# Altium schematic sheet MCU.SchDoc
size 420 x 297 mm; SheetNumber: 12; SheetTotal: 13
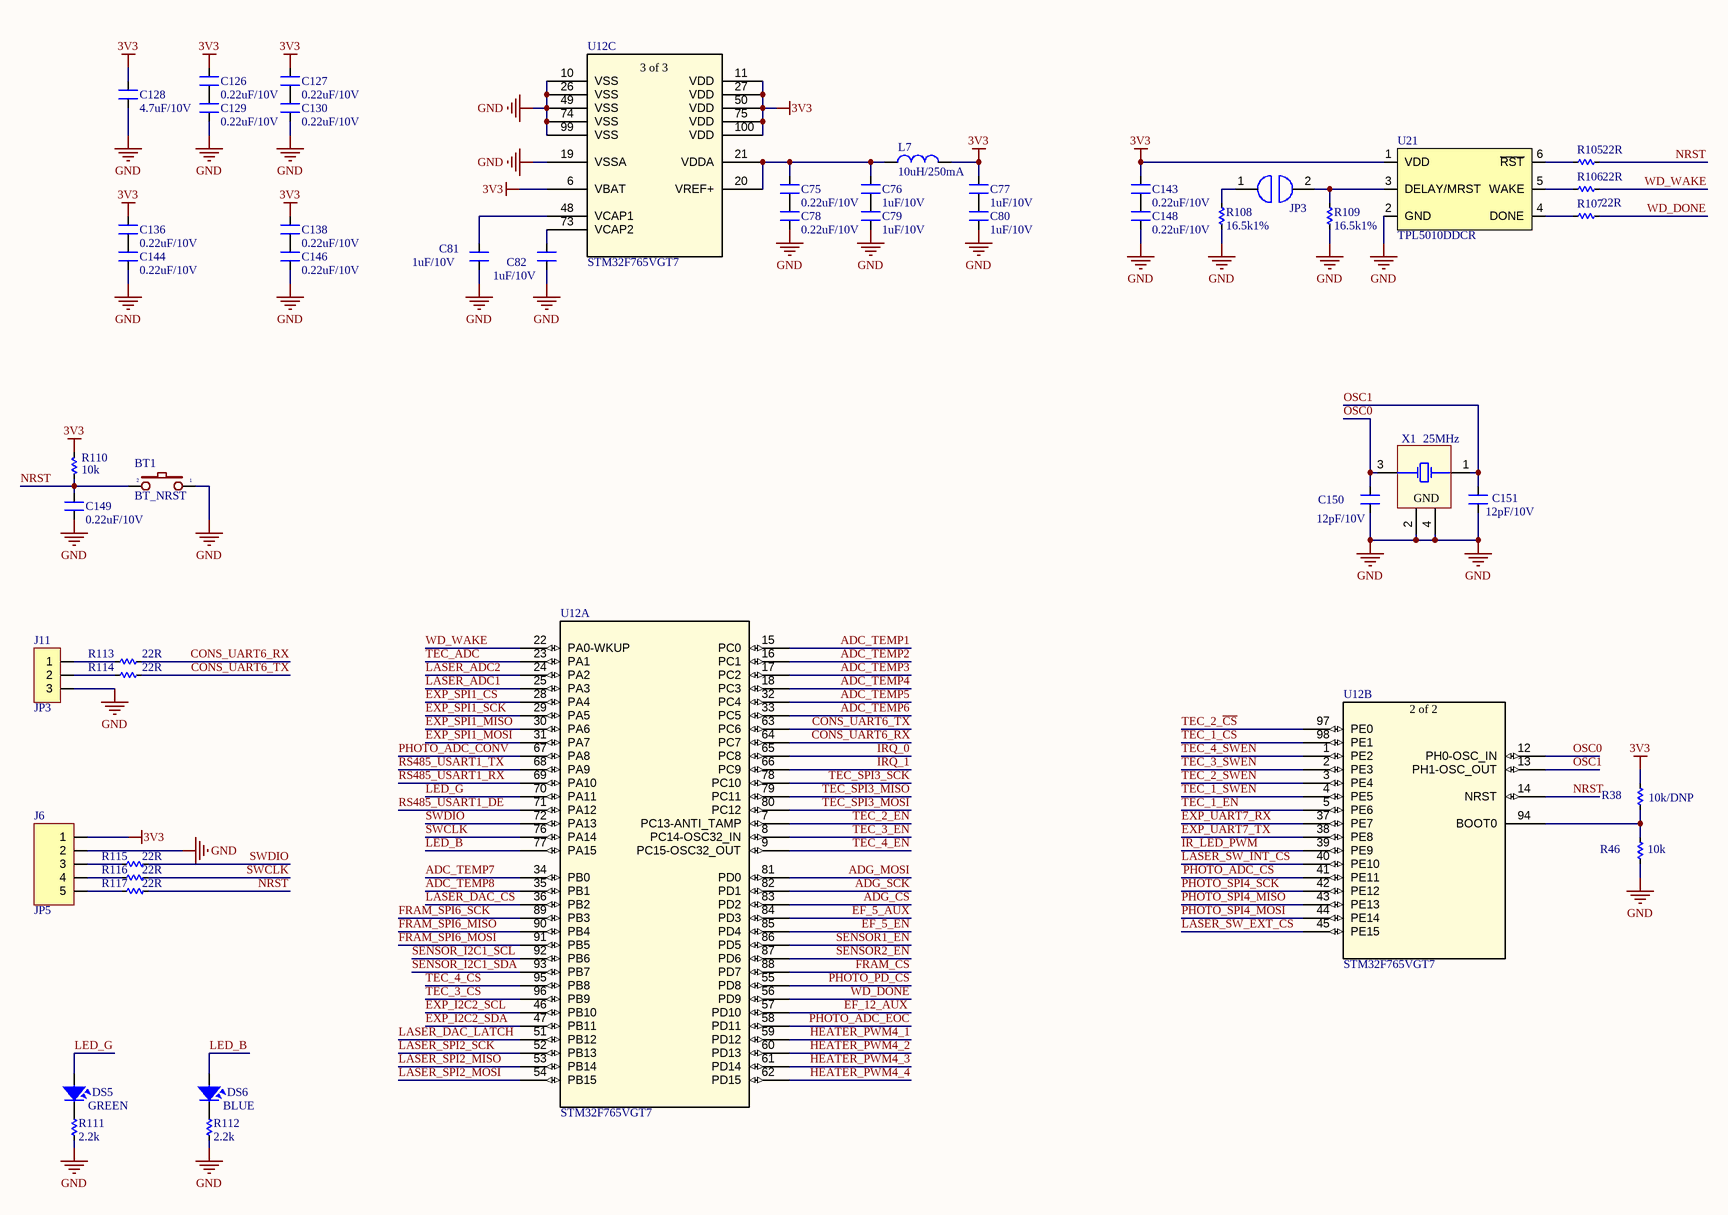
[diagram p0: MCU.SchDoc]

## Parts
BT1  BT_NRST  [SW1-SMD]
C75  0.22uF/10V  [CAP_C_1608X80]
C76  1uF/10V  [CAP_C_1608X80]
C77  1uF/10V  [CAP_C_1608X80]
C78  0.22uF/10V  [CAP_C_1608X80]
C79  1uF/10V  [CAP_C_1608X80]
C80  1uF/10V  [CAP_C_1608X80]
C81  1uF/10V  [CAP_C_1608X80]
C82  1uF/10V  [CAP_C_1608X80]
C126  0.22uF/10V  [CAP_C_1608X80]
C127  0.22uF/10V  [CAP_C_1608X80]
C128  4.7uF/10V  [CAP_C_1608X80]
C129  0.22uF/10V  [CAP_C_1608X80]
C130  0.22uF/10V  [CAP_C_1608X80]
C136  0.22uF/10V  [CAP_C_1608X80]
C138  0.22uF/10V  [CAP_C_1608X80]
C143  0.22uF/10V  [CAP_C_1608X80]
C144  0.22uF/10V  [CAP_C_1608X80]
C146  0.22uF/10V  [CAP_C_1608X80]
C148  0.22uF/10V  [CAP_C_1608X80]
C149  0.22uF/10V  [CAP_C_1608X80]
C150  12pF/10V  [CAP_C_1608X80]
C151  12pF/10V  [CAP_C_1608X80]
DS5  GREEN  [LED-0603-BLUE]
DS6  BLUE  [LED-0603-BLUE]
J6  JP5  [JP5-D1C]
J11  JP3  [JP3-D1C]
JP3  jumper2  [JUMPER2]  (value not drawn)
L7  10uH/250mA  [L-SMD-0603]
R38  10k/DNP  [RES_C_1608X60]
R46  10k  [RES_C_1608X60]
R105  22R  [RES_C_1608X60]
R106  22R  [RES_C_1608X60]
R107  22R  [RES_C_1608X60]
R108  16.5k1%  [RES_C_1608X60]
R109  16.5k1%  [RES_C_1608X60]
R110  10k  [RES_C_1608X60]
R111  2.2k  [RES_C_1608X60]
R112  2.2k  [RES_C_1608X60]
R113  22R  [RES_C_1608X60]
R114  22R  [RES_C_1608X60]
R115  22R  [RES_C_1608X60]
R116  22R  [RES_C_1608X60]
R117  22R  [RES_C_1608X60]
U12  STM32F765VGT7  [LQFP100_STM]  (parts A,B,C of 3)
U21  TPL5010DDCR  [TPL5010DDCR]
X1  25MHz  [XTAL_ECS-250-12-33Q-JES-TR]

## Nets
3V3: C77.2 C126.2 C127.2 C128.2 C136.2 C138.2 C143.2 J6.1 L7.1 R38.1 R110.1 U12.6(VBAT) U12.11(VDD) U12.27(VDD) U12.50(VDD) U12.75(VDD) U12.100(VDD) U21.1(VDD)
GND: BT1.1 C78.1 C79.1 C80.1 C81.1 C82.1 C128.1 C129.1 C130.1 C144.1 C146.1 C148.1 C149.1 C150.2 C151.1 J6.2 J11.3 R46.2 R108.1 R109.1 R111.2 R112.2 U12.10(VSS) U12.19(VSSA) U12.26(VSS) U12.49(VSS) U12.74(VSS) U12.99(VSS) U21.2(GND) X1.2(GND) X1.4(GND)
ADC_TEMP1: U12.15(PC0)
ADC_TEMP2: U12.16(PC1)
ADC_TEMP3: U12.17(PC2)
ADC_TEMP4: U12.18(PC3)
ADC_TEMP5: U12.32(PC4)
ADC_TEMP6: U12.33(PC5)
ADC_TEMP7: U12.34(PB0)
ADC_TEMP8: U12.35(PB1)
ADG_CS: U12.83(PD2)
ADG_MOSI: U12.81(PD0)
ADG_SCK: U12.82(PD1)
CONS_UART6_RX: R113.1 U12.64(PC7)
CONS_UART6_TX: R114.1 U12.63(PC6)
EF_5_AUX: U12.84(PD3)
EF_5_EN: U12.85(PD4)
EF_12_AUX: U12.57(PD10)
EXP_I2C2_SCL: U12.46(PB10)
EXP_I2C2_SDA: U12.47(PB11)
EXP_SPI1_CS: U12.28(PA4)
EXP_SPI1_MISO: U12.30(PA6)
EXP_SPI1_MOSI: U12.31(PA7)
EXP_SPI1_SCK: U12.29(PA5)
EXP_UART7_RX: U12.37(PE7)
EXP_UART7_TX: U12.38(PE8)
FRAM_CS: U12.88(PD7)
FRAM_SPI6_MISO: U12.90(PB4)
FRAM_SPI6_MOSI: U12.91(PB5)
FRAM_SPI6_SCK: U12.89(PB3)
HEATER_PWM4_1: U12.59(PD12)
HEATER_PWM4_2: U12.60(PD13)
HEATER_PWM4_3: U12.61(PD14)
HEATER_PWM4_4: U12.62(PD15)
IR_LED_PWM: U12.39(PE9)
IRQ_0: U12.65(PC8)
IRQ_1: U12.66(PC9)
LASER_ADC1: U12.25(PA3)
LASER_ADC2: U12.24(PA2)
LASER_DAC_CS: U12.36(PB2)
LASER_DAC_LATCH: U12.51(PB12)
LASER_SPI2_MISO: U12.53(PB14)
LASER_SPI2_MOSI: U12.54(PB15)
LASER_SPI2_SCK: U12.52(PB13)
LASER_SW_EXT_CS: U12.45(PE15)
LASER_SW_INT_CS: U12.40(PE10)
LED_B: DS6.1 U12.77(PA15)
LED_G: DS5.1 U12.70(PA11)
NRST: BT1.2 C149.2 R105.2 R110.2 R117.1 U12.14(NRST)
OSC0: C150.1 U12.12(PH0-OSC_IN) X1.3(XTAL)
OSC1: C151.2 U12.13(PH1-OSC_OUT) X1.1(XTAL)
PHOTO_ADC_CONV: U12.67(PA8)
PHOTO_ADC_CS: U12.41(PE11)
PHOTO_ADC_EOC: U12.58(PD11)
PHOTO_PD_CS: U12.55(PD8)
PHOTO_SPI4_MISO: U12.43(PE13)
PHOTO_SPI4_MOSI: U12.44(PE14)
PHOTO_SPI4_SCK: U12.42(PE12)
RS485_USART1_DE: U12.71(PA12)
RS485_USART1_RX: U12.69(PA10)
RS485_USART1_TX: U12.68(PA9)
SENSOR1_EN: U12.86(PD5)
SENSOR2_EN: U12.87(PD6)
SENSOR_I2C1_SCL: U12.92(PB6)
SENSOR_I2C1_SDA: U12.93(PB7)
SWCLK: R116.1 U12.76(PA14)
SWDIO: R115.1 U12.72(PA13)
TEC_1_~{CS}: U12.98(PE1)
TEC_1_EN: U12.5(PE6)
TEC_1_SWEN: U12.4(PE5)
TEC_2_~{CS}: U12.97(PE0)
TEC_2_EN: U12.7(PC13-ANTI_TAMP)
TEC_2_SWEN: U12.3(PE4)
TEC_3_~{CS}: U12.96(PB9)
TEC_3_EN: U12.8(PC14-OSC32_IN)
TEC_3_SWEN: U12.2(PE3)
TEC_4_~{CS}: U12.95(PB8)
TEC_4_EN: U12.9(PC15-OSC32_OUT)
TEC_4_SWEN: U12.1(PE2)
TEC_ADC: U12.23(PA1)
TEC_SPI3_MISO: U12.79(PC11)
TEC_SPI3_MOSI: U12.80(PC12)
TEC_SPI3_SCK: U12.78(PC10)
WD_DONE: R107.2 U12.56(PD9)
WD_WAKE: R106.2 U12.22(PA0-WKUP)
NetC75_1: C75.1 C78.2
NetC75_2: C75.2 C76.2 L7.2 U12.20(VREF+) U12.21(VDDA)
NetC76_1: C76.1 C79.2
NetC77_1: C77.1 C80.2
NetC81_2: C81.2 U12.48(VCAP1)
NetC82_2: C82.2 U12.73(VCAP2)
NetC126_1: C126.1 C129.2
NetC127_1: C127.1 C130.2
NetC136_1: C136.1 C144.2
NetC138_1: C138.1 C146.2
NetC143_1: C143.1 C148.2
NetDS5_2: DS5.2 R111.1
NetDS6_2: DS6.2 R112.1
NetJ6_3: J6.3 R115.2
NetJ6_4: J6.4 R116.2
NetJ6_5: J6.5 R117.2
NetJ11_1: J11.1 R113.2
NetJ11_2: J11.2 R114.2
NetJP3_1: JP3.1 R108.2
NetJP3_2: JP3.2 R109.2 U21.3(DELAY/MRST)
NetR38_2: R38.2 R46.1 U12.94(BOOT0)
NetR105_1: R105.1 U21.6(~{RST})
NetR106_1: R106.1 U21.5(WAKE)
NetR107_1: R107.1 U21.4(DONE)

## Notes on the sheet
- Project:
- BEE-PC1
- Sub-system:
- NANORACK_EXP_CONTROLLER
- Design by:
- SANG HUYNH
- BAO BUI Q.
- Sheet title:
- Sheet
- A3
- of
- Checked by:
- Approved by:
- VU PHAM
- Revision:
- Document No:
- V1.1.1
- Size:
- Date:
- (in symbol STM32F765VGT7, part B) 2 of 2
- (in symbol STM32F765VGT7, part C) 3 of 3

## Library data of the parts
BT1 = SW2: Switch button 2 pin; Value: SW chip 2 pin
C75-C82 C126-C130 C136 C138 C143 C144 C146 C148-C151 = Capacitors: Value: 33pF
DS5 DS6 = LED SMD: Value: LED 3 - 5 ly 2 Colour
J6 = JP5: WR-PHD 2.54 mm Angled Socket Header; Manufacturer: W¨¹rth Elektronik eiSos GmbH; partNo: 613005143121; ComponentLink1 Description: Manufacturer; ComponentLink2 Description: Datasheet; NoPins: 05; Created Date: 29 March 2013; ComponentLink1URL: http://www.we-online.com; ComponentLink2URL: http://katalog.we-online.de/em/datasheet/6130xx143121.pdf; Created by: Karrer Zheng
J11 = JP3: WR-PHD 2.54 mm Angled Socket Header; Manufacturer: W¨¹rth Elektronik eiSos GmbH; partNo: 613003143121; ComponentLink1 Description: Manufacturer; ComponentLink2 Description: Datasheet; NoPins: 03; Created Date: 29 March 2013; ComponentLink1URL: http://www.we-online.com; ComponentLink2URL: http://katalog.we-online.de/em/datasheet/6130xx143121.pdf; Created by: Karrer Zheng
JP3 = JUMPER
L7 = L-SMD-1: partNo: 78477010; Manufacturer: Wurth Elektronik; Inductance: 1.0 μH; ComponentLink1Description: Manufacturer; ComponentLink1URL: http://www.we-online.de; Created by: Baojun Chen; Created Date: Nov.2015; ComponentLink2Description: Datasheet; ComponentLink2URL: http://katalog.we-online.de/pbs/datasheet/78477010.pdf
R38 R46 R105-R117 = Res SMD: SMD; Manufacturer: Generic Components; Class: Passive; Published: 08/06/2000; Publisher: Altium Hobart Technology Centre
U12 = STM32F765VGT7: No Description Available; Mfr_Name: STMicroelectronics; RefDes: RefDes; Type: Type
U21 = TPL5010DDCR: IC OSC PROG TIMER TSOT23-6
X1 = XT4: Crystal, 8 MHz, -30 to 85 degC, 3.2 x 2.5 x 0.9 mm SMD; Value: 4Mhz